# EAGLE design Tiny15L-Board (EAGLE 4.15)
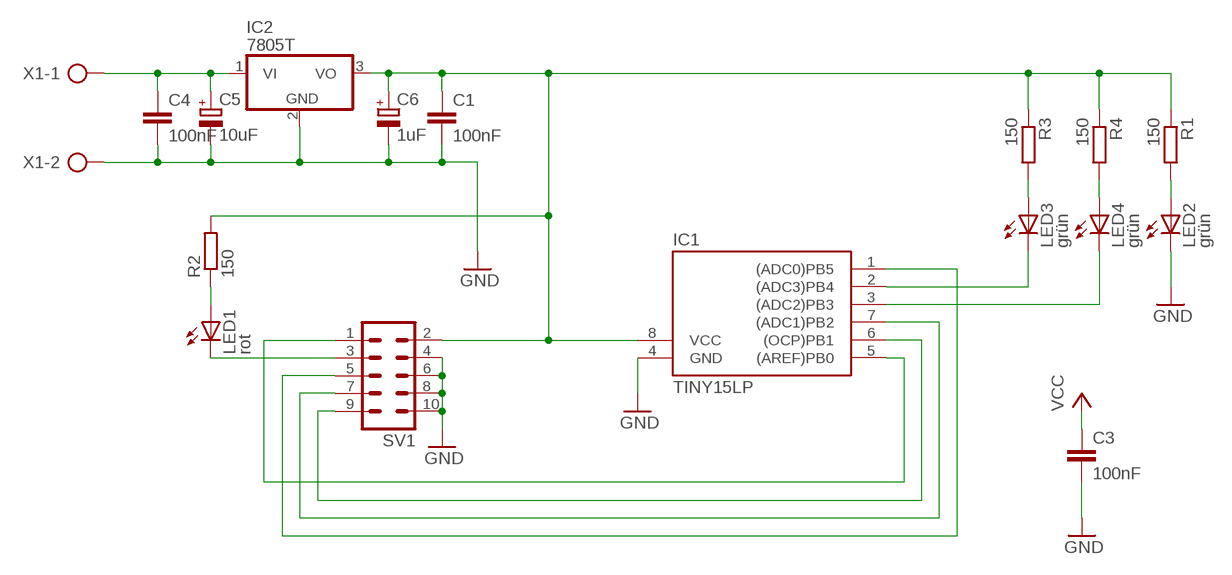
[diagram p0: schematic, sheet 1]

## Parts
C1  100nF  C-EU025-030X050  [C025-030X050]
C3  100nF  C-EU025-030X050  [C025-030X050]
C4  100nF  C-EU025-030X050  [C025-030X050]
C5  10uF  CPOL-EUE2.5-7  [E2,5-7]
C6  1uF  CPOL-EUE2.5-5  [E2,5-5]
IC1  TINY15LP  [DIL08]
IC2  7805T  [TO220H]
LED1  rot  LED3MM  [LED3MM]
LED2  grün  LED3MM  [LED3MM]
LED3  grün  LED3MM  [LED3MM]
LED4  grün  LED3MM  [LED3MM]
R1  150  R-EU_0207/10  [0207/10]
R2  150  R-EU_0207/10  [0207/10]
R3  150  R-EU_0207/10  [0207/10]
R4  150  R-EU_0207/10  [0207/10]
SV1  ML10  [ML10]
X1  AK500/2  [AK500/2]

## Nets
GND: C1.2 C3.2 C4.2 C5.- C6.- IC1.4(GND) IC2.2(GND) LED2.K(C) SV1.4 SV1.6 SV1.8 SV1.10 X1.2
MISO: IC1.6((OCP)PB1) SV1.9
MOSI: IC1.5((AREF)PB0) SV1.1
N$1: C4.1 C5.+ IC2.1(VI) X1.1
N$2: LED1.A R2.1
N$3: LED2.A R1.2
N$4: LED1.K(C) SV1.3
N$5: LED4.A R4.2
N$6: LED3.A R3.2
N$7: IC1.2((ADC3)PB4) LED3.K(C)
N$8: IC1.3((ADC2)PB3) LED4.K(C)
RESET: IC1.1((ADC0)PB5) SV1.5
SCK: IC1.7((ADC1)PB2) SV1.7
VCC: C1.1 C3.1 C6.+ IC1.8(VCC) IC2.3(VO) R1.1 R2.2 R3.1 R4.1 SV1.2

## Library data of the parts
C1 C3 C4 = rcl:C-EU: CAPACITOR, European symbol
C5 C6 = rcl:CPOL-EU: POLARIZED CAPACITOR, European symbol
IC1 = atmel:TINY15L: MICROCONTROLLER 2.7 V 1 Kbytes FLASH 64 bytes EEPROM 4-channel 10 bit ADC
IC2 = linear:78*: Positive VOLTAGE REGULATOR Source: http://cache.national.com/ds/LM/LM78L05.pdf http://www.fairchildsemi.com/ds/LM/LM7805.pdf
LED1-LED4 = led:LED: LED OSRAM: - CHIPLED LG R971, LG N971, LY N971, LG Q971, LY Q971, LO R971, LY R971 LH N974, LH R974 LS Q976, LO Q976, LY Q976 LO Q996 - Hyper CHIPLED LW Q18S LB Q993, LB Q99A, LB R99A - SideLED LS A670, LO A670, LY A670, LG A670, LP A670 LB A673, LV A673, LT A673, LW A673 LH A674 LY A675 LS A676, LA A676, LO A676, LY A676, LW A676 LS A679, LY A679, LG A679 - Hyper Micro SIDELED® LS Y876, LA Y876, LO Y876, LY Y876 LT Y87S - SmartLED LW L88C, LW L88S LB L89C, LB L89S, LG L890 LS L89K, LO L89K, LY L89K LS L896, LA L896, LO L896, LY L896 - TOPLED LS T670, LO T670, LY T670, LG T670, LP T670 LSG T670, LSP T670, LSY T670, LOP T670, LYG T670 LG T671, LOG T671, LSG T671 LB T673, LV T673, LT T673, LW T673 LH T674 LS T676, LA T676, LO T676, LY T676, LB T676, LH T676, LSB T676, LW T676 LB T67C, LV T67C, LT T67C, LS T67K, LO T67K, LY T67K, LW E67C LS E67B, LA E67B, LO E67B, LY E67B, LB E67C, LV E67C, LT E67C LW T67C LS T679, LY T679, LG T679 LS T770, LO T770, LY T770, LG T770, LP T770 LB T773, LV T773, LT T773, LW T773 LH T774 LS E675, LA E675, LY E675, LS T675 LS T776, LA T776, LO T776, LY T776, LB T776 LHGB T686 LT T68C, LB T68C - Hyper Mini TOPLED® LB M676 - Mini TOPLED Santana® LG M470 LS M47K, LO M47K, LY M47K Source: http://www.osram.convergy.de/
R1-R4 = rcl:R-EU_: RESISTOR, European symbol
SV1 = con-harting-ml:ML10: HARTING
X1 = con-ptr500:AK500/2: CONNECTOR

## Board
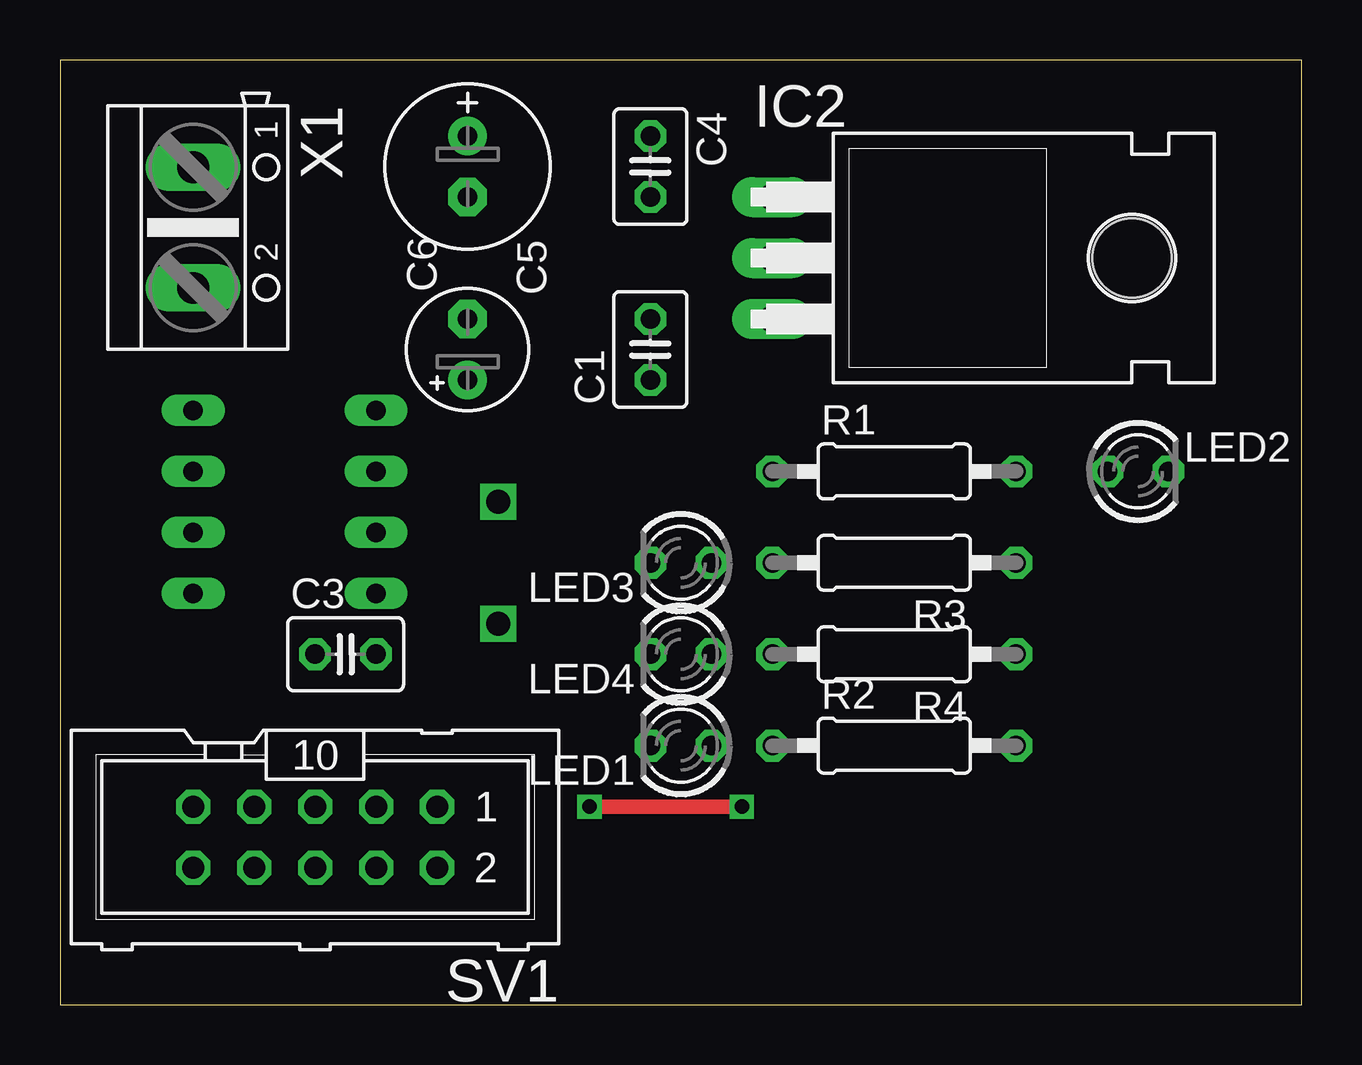
[diagram p1: board, top side]
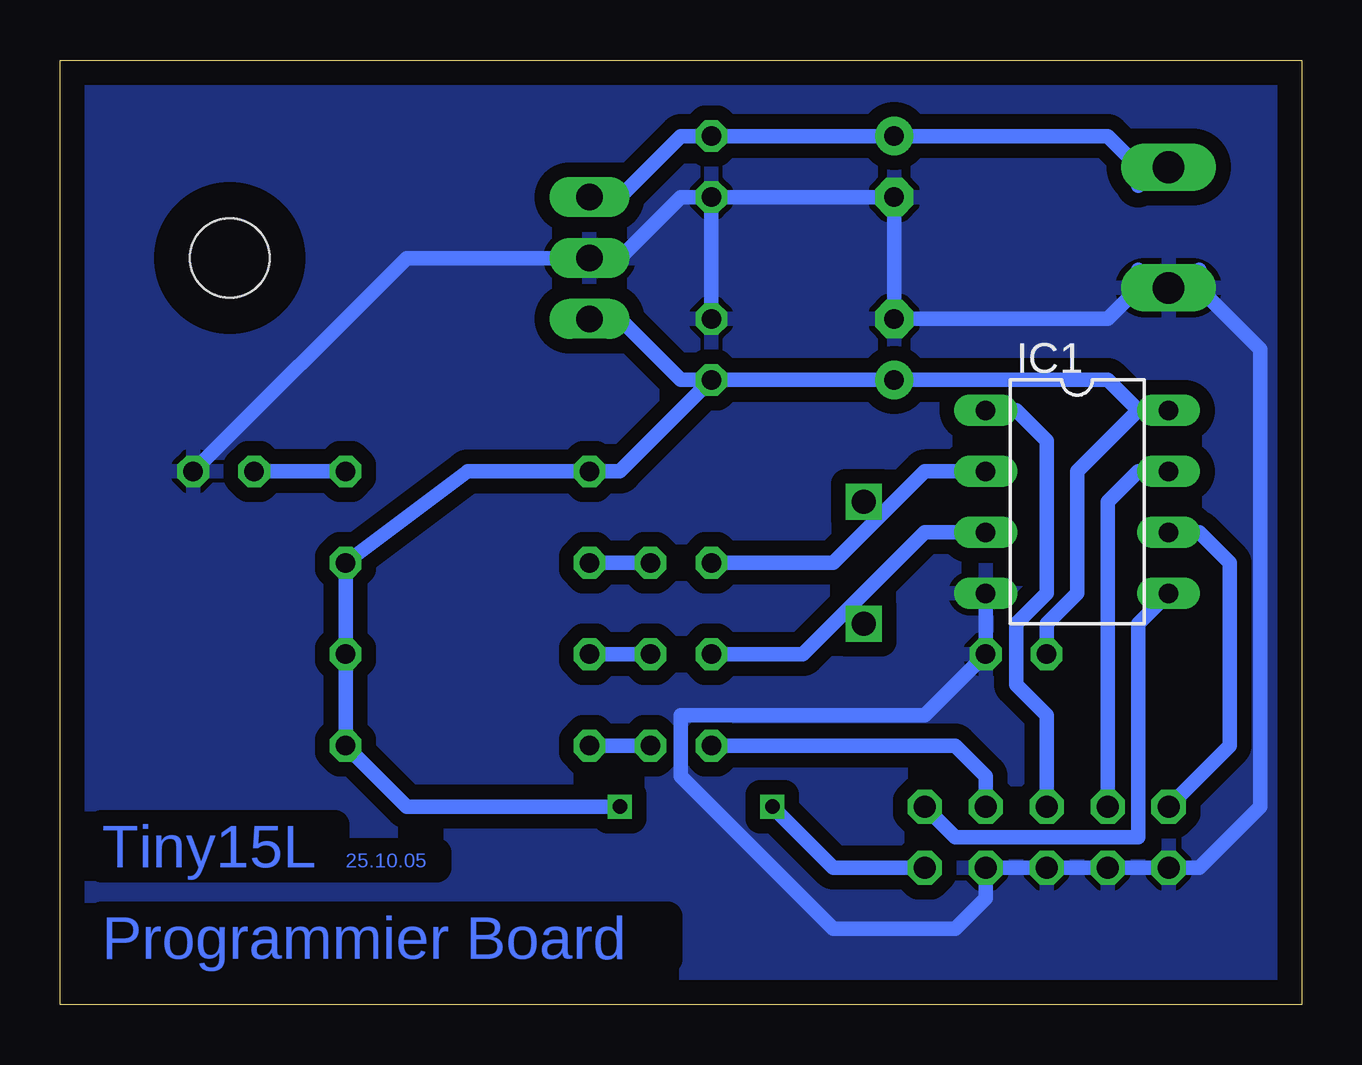
[diagram p2: board, bottom side, seen from below]

Size 51.74 x 39.36 mm. Coordinates in mm from the lower left corner, seen from the top.
Outline: 0,0 51.74,0 51.74,39.36 0,39.36 0,0
Copper layers (1*16): Top 0.035mm / dielectric 1.5mm / Bottom 0.035mm
Design rules "default": minimum track width 10mil, minimum drill 24mil, track to track 8mil, track to pad 8mil, pad to pad 8mil, via to via 8mil, smd to smd 8mil, copper to edge 40mil, drill to drill 8mil, minimum pad ring 10mil, minimum via ring 8mil, stop-mask expansion 4mil, vias tented up to drill 0mil, thermal gap 10mil

### Footprints (pad centres in the part's own frame; a part is rotated, then mirrored left to right if it is on the bottom)
C025-030X050 = drill 0.813 octagon: 1 -1.27,0; 2 1.27,0
E2,5-7 = drill 0.813 pad 1.6 round: + -1.27,0 | drill 0.813 pad 1.6 octagon: - 1.27,0
E2,5-5 = drill 0.813 pad 1.6 round: + -1.27,0 | drill 0.813 pad 1.6 octagon: - 1.27,0
DIL08 = drill 0.813 long: 1 -3.81,-3.81; 2 -1.27,-3.81; 3 1.27,-3.81; 4 3.81,-3.81; 5 3.81,3.81; 6 1.27,3.81; 7 -1.27,3.81; 8 -3.81,3.81
TO220H = drill 1.118 long: 1 -2.54,-10.16; 2 0,-10.16; 3 2.54,-10.16 | hole 3.302: 0,4.826
LED3MM = drill 0.813 octagon: A -1.27,0; K 1.27,0
0207/10 = drill 0.813 octagon: 1 -5.08,0; 2 5.08,0
ML10 = drill 0.914 octagon: 1 -5.08,-1.27; 2 -5.08,1.27; 3 -2.54,-1.27; 4 -2.54,1.27; 5 0,-1.27; 6 0,1.27; 7 2.54,-1.27; 8 2.54,1.27; 9 5.08,-1.27; 10 5.08,1.27
AK500/2 = drill 1.321 long: 1 -2.515,0; 2 2.515,0

### Placement (x,y rotation side)
C1  24.6,27.3 90 top
C3  11.9,14.6 0 top
C4  24.6,34.92 270 top
C5  16.98,34.92 270 top
C6  16.98,27.3 90 top
IC1  9.36,20.95 270 bottom
IC2  39.84,31.11 270 top
LED1  25.87,10.79 180 top
LED2  44.92,22.22 0 top
LED3  25.87,18.41 180 top
LED4  25.87,14.6 180 top
R1  34.76,22.22 0 top
R2  34.76,10.79 0 top
R3  34.76,18.41 180 top
R4  34.76,14.6 180 top
SV1  10.63,6.98 180 top
X1  5.55,32.38 270 top

### Tracks (layer width: path | path; a pad name or v marks a point on that pad's centre or on a via)
GND
  Bottom 0.61: C4.2 C1.2 | C4.2 C5.- C6.- 8.09,28.57 6.82,29.84 | C4.2 25.87,33.65 28.41,31.11 IC2.2 37.3,31.11 LED2.K | 4.28,29.84 4.28,30.63 | 6.82,29.84 6.82,30.63 | 6.82,29.84 6.82,29.87 X1.2 4.28,29.87 4.28,29.84 | 4.28,29.84 6.82,29.84 | 4.28,29.84 1.74,27.3 1.74,8.25 4.28,5.71 SV1.10 SV1.8 SV1.6 SV1.4 13.17,4.44 14.44,3.17 19.52,3.17 25.87,9.52 25.87,12.06 15.71,12.06 C3.2 IC1.4
  pour Bottom (isolate 0.61): -0.8,40 -0.8,-0.64 52.54,-0.64 52.54,40
MISO
  Bottom 0.61: SV1.9 3.01,10.79 3.01,18.41 4.28,19.68 IC1.6
MOSI
  Bottom 0.61: SV1.1 14.44,6.98 6.82,6.98 6.82,15.87 IC1.5
N$1
  Bottom 0.61: IC2.1 28.41,33.65 25.87,36.19 C4.1 C5.+ 8.09,36.19 6.82,34.92 | 6.82,34.92 6.82,34.13 | X1.1 6.82,34.9 6.82,34.92
N$2
  Bottom 0.61: LED1.A R2.1
N$3
  Bottom 0.61: R1.2 LED2.A
N$4
  Bottom 0.61: SV1.3 13.17,9.52 14.44,10.79 LED1.K
N$5
  Bottom 0.61: LED4.A R4.2
N$6
  Bottom 0.61: LED3.A R3.2
N$7
  Bottom 0.61: 16.98,20.95 19.52,18.41 LED3.K | 16.98,20.95 16.34,21.59 | IC1.2 15.71,22.22 16.98,20.95
N$8
  Bottom 0.61: LED4.K 20.79,14.6 15.71,19.68 IC1.3
N$9  (via drill 1)
  other vias: 18.25,20.95
N$10  (via drill 1)
  other vias: 18.25,15.87
RESET
  Bottom 0.61: SV1.5 10.63,12.06 11.9,13.33 11.9,15.87 10.63,17.14 10.63,23.49 11.9,24.76 IC1.1
SCK
  Bottom 0.61: SV1.7 8.09,20.95 6.82,22.22 IC1.7
VCC  (via drill 0.6)
  Top 0.61: v22.06,8.25 v28.41,8.25
  Bottom 0.61: C1.1 C6.+ 8.09,26.03 6.82,24.76 | C1.1 25.87,26.03 28.41,28.57 IC2.3 | C1.1 28.41,22.22 R1.1 34.76,22.22 R3.1 R4.1 R2.2 37.3,8.25 v28.41,8.25 | C3.1 10.63,15.87 9.36,17.14 9.36,22.22 6.82,24.76 | SV1.2 19.52,5.71 v22.06,8.25 | 6.82,24.76 IC1.8

### Text on the board
Bottom: 25.10.05 | Tiny15L | Programmier Board